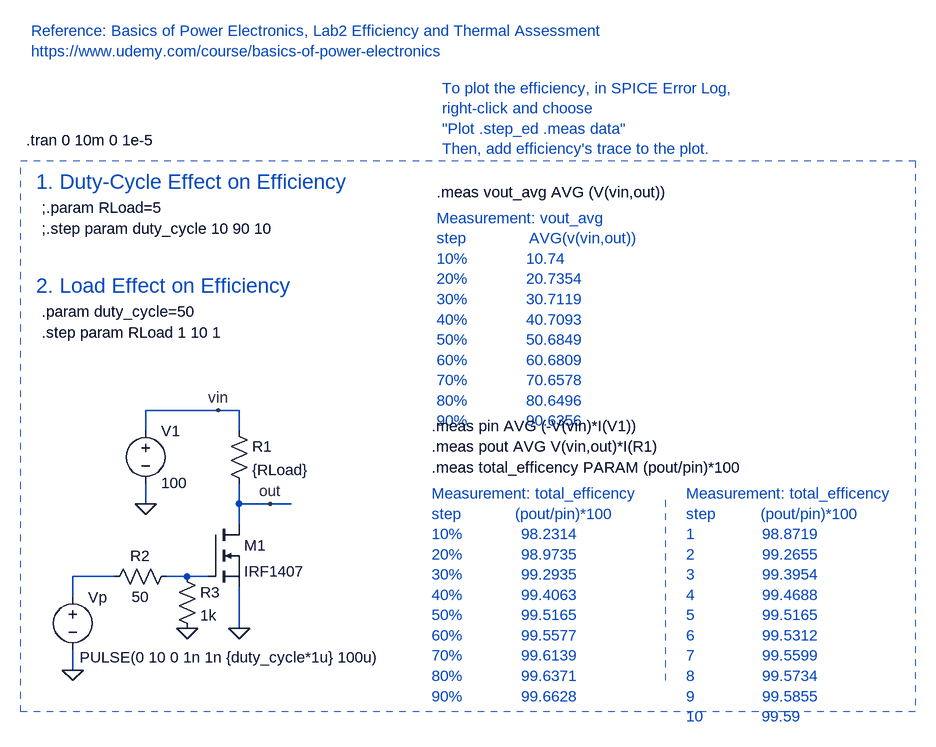
[diagram p0: schematic 15-nmos_chopper_efficiency.asc]
15-nmos_chopper_efficiency.asc, the LTspice schematic file:
Version 4
SHEET 1 1760 1716
WIRE 336 336 224 336
WIRE 368 336 336 336
WIRE 224 368 224 336
WIRE 368 368 368 336
WIRE 224 480 224 448
WIRE 368 480 368 448
WIRE 416 480 368 480
WIRE 448 480 416 480
WIRE 368 512 368 480
WIRE 176 592 112 592
WIRE 288 592 256 592
WIRE 320 592 288 592
WIRE 112 624 112 592
WIRE 368 672 368 608
WIRE 112 736 112 704
FLAG 224 480 0
FLAG 112 736 0
FLAG 368 672 0
FLAG 416 480 out
FLAG 336 336 vin
FLAG 288 672 0
SYMBOL voltage 224 352 R0
WINDOW 123 0 0 Left 0
WINDOW 39 0 0 Left 0
SYMATTR InstName V1
SYMATTR Value 100
SYMBOL voltage 112 608 R0
WINDOW 3 11 108 Left 2
WINDOW 123 0 0 Left 0
WINDOW 39 0 0 Left 0
SYMATTR Value PULSE(0 10 0 1n 1n {duty_cycle*1u} 100u)
SYMATTR InstName Vp
SYMBOL res 272 576 R90
WINDOW 0 0 56 VBottom 2
WINDOW 3 32 56 VTop 2
SYMATTR InstName R2
SYMATTR Value 50
SYMBOL res 352 352 R0
SYMATTR InstName R1
SYMATTR Value {RLoad}
SYMBOL nmos 320 512 R0
SYMATTR InstName M1
SYMATTR Value IRF1407
SYMBOL res 272 576 R0
SYMATTR InstName R3
SYMATTR Value 1k
TEXT 40 -80 Left 2 !.tran 0 10m 0 1e-5
TEXT 48 -248 Left 2 ;Reference: Basics of Power Electronics, Lab2 Efficiency and Thermal Assessment\nhttps://www.udemy.com/course/basics-of-power-electronics
TEXT 64 56 Left 2 !;.step param duty_cycle 10 90 10
TEXT 672 0 Left 2 !.meas vout_avg AVG (V(vin,out))
TEXT 672 40 Left 2 ;Measurement: vout_avg\nstep              AVG(v(vin,out))\n10%             10.74\n20%             20.7354\n30%             30.7119\n40%             40.7093\n50%             50.6849\n60%             60.6809\n70%             70.6578\n80%             80.6496\n90%             90.6356
TEXT 664 360 Left 2 !.meas pin AVG (-V(vin)*I(V1))
TEXT 664 392 Left 2 !.meas pout AVG V(vin,out)*I(R1)
TEXT 664 424 Left 2 !.meas total_efficency PARAM (pout/pin)*100
TEXT 664 464 Left 2 ;Measurement: total_efficency\nstep            (pout/pin)*100\n10%             98.2314\n20%             98.9735\n30%             99.2935\n40%             99.4063\n50%             99.5165\n60%             99.5577\n70%             99.6139\n80%             99.6371\n90%             99.6628
TEXT 56 -16 Left 3 ;1. Duty-Cycle Effect on Efficiency
TEXT 680 -160 Left 2 ;To plot the efficiency, in SPICE Error Log, \nright-click and choose\n"Plot .step_ed .meas data"\nThen, add efficiency's trace to the plot.
TEXT 56 144 Left 3 ;2. Load Effect on Efficiency
TEXT 64 184 Left 2 !.param duty_cycle=50
TEXT 64 24 Left 2 !;.param RLoad=5
TEXT 64 216 Left 2 !.step param RLoad 1 10 1
TEXT 1056 464 Left 2 ;Measurement: total_efficency\nstep          (pout/pin)*100\n1               98.8719\n2               99.2655\n3               99.3954\n4               99.4688\n5               99.5165\n6               99.5312\n7               99.5599\n8               99.5734\n9               99.5855\n10             99.59
LINE Normal 1024 752 1024 464 1
RECTANGLE Normal 1408 800 32 -48 1

The netlist it stands for:
* 15-nmos_chopper_efficiency.asc
V1 vin 0 100
Vp N001 0 PULSE(0 10 0 1n 1n {duty_cycle*1u} 100u)
R2 N002 N001 50
R1 vin out {RLoad}
M1 out N002 0 0 IRF1407
R3 N002 0 1k
.model NMOS NMOS
.model PMOS PMOS
.lib standard.mos
.tran 0 10m 0 1e-5
* Reference: Basics of Power Electronics, Lab2 Efficiency and Thermal Assessment
* https://www.udemy.com/course/basics-of-power-electronics
;.step param duty_cycle 10 90 10
.meas vout_avg AVG (V(vin,out))
* Measurement: vout_avg
* step              AVG(v(vin,out))
* 10%             10.74
* 20%             20.7354
* 30%             30.7119
* 40%             40.7093
* 50%             50.6849
* 60%             60.6809
* 70%             70.6578
* 80%             80.6496
* 90%             90.6356
.meas pin AVG (-V(vin)*I(V1))
.meas pout AVG V(vin,out)*I(R1)
.meas total_efficency PARAM (pout/pin)*100
* Measurement: total_efficency
* step            (pout/pin)*100
* 10%             98.2314
* 20%             98.9735
* 30%             99.2935
* 40%             99.4063
* 50%             99.5165
* 60%             99.5577
* 70%             99.6139
* 80%             99.6371
* 90%             99.6628
* 1. Duty-Cycle Effect on Efficiency
* To plot the efficiency, in SPICE Error Log,
* right-click and choose
* "Plot .step_ed .meas data"
* Then, add efficiency's trace to the plot.
* 2. Load Effect on Efficiency
.param duty_cycle=50
;.param RLoad=5
.step param RLoad 1 10 1
* Measurement: total_efficency
* step          (pout/pin)*100
* 1               98.8719
* 2               99.2655
* 3               99.3954
* 4               99.4688
* 5               99.5165
* 6               99.5312
* 7               99.5599
* 8               99.5734
* 9               99.5855
* 10             99.59
.backanno
.end